# EAGLE schematic uvfoto-avr (EAGLE 6.4)
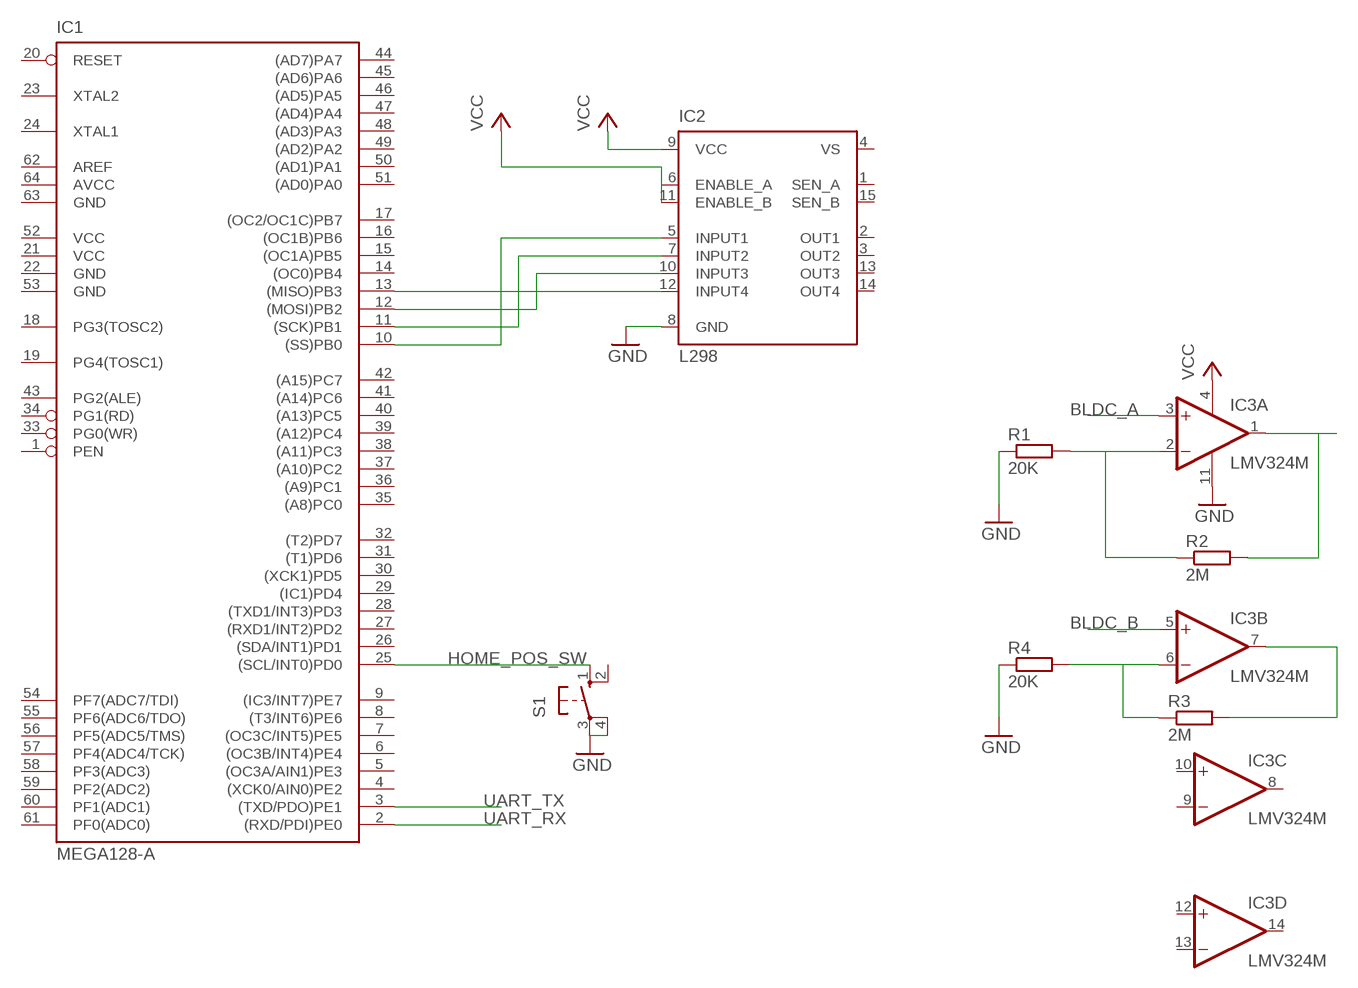
[diagram p0: schematic, sheet 1]

## Parts
IC1  MEGA128-A  [TQFP64]
IC2  L298  [MULTIWATT-15]
IC3  LMV324M  [SO14]
R1  20K  R-EU_0207/10  [0207/10]
R2  2M  R-EU_0207/10  [0207/10]
R3  2M  R-EU_0207/10  [0207/10]
R4  20K  R-EU_0207/10  [0207/10]
S1  10-XX  [B3F-10XX]

## Nets
BLDC_A: IC3.3(A:+IN)
BLDC_B: IC3.5(B:+IN)
GND: IC2.8(GND) IC3.11(P:V-) R1.1 R4.1 S1.4(P1)
HOME_POS_SW: IC1.25((SCL/INT0)PD0) S1.1(S)
IO_PHASE_1: IC3.1(A:OUT) R2.2
N$2: IC1.10((SS)PB0) IC2.5(INPUT1)
N$3: IC1.11((SCK)PB1) IC2.7(INPUT2)
N$4: IC1.12((MOSI)PB2) IC2.10(INPUT3)
N$5: IC1.13((MISO)PB3) IC2.12(INPUT4)
N$6: IC3.2(A:-IN) R1.2 R2.1
N$8: IC3.6(B:-IN) R3.1 R4.2
N$9: IC3.7(B:OUT) R3.2
UART_RX: IC1.2((RXD/PDI)PE0)
UART_TX: IC1.3((TXD/PDO)PE1)
VCC: IC2.9(VCC) IC2.11(ENABLE_B) IC3.4(P:V+)
Unconnected: IC1.1(PEN) IC1.4((XCK0/AIN0)PE2) IC1.5((OC3A/AIN1)PE3) IC1.6((OC3B/INT4)PE4) IC1.7((OC3C/INT5)PE5) IC1.8((T3/INT6)PE6) IC1.9((IC3/INT7)PE7) IC1.14((OC0)PB4) IC1.15((OC1A)PB5) IC1.16((OC1B)PB6) IC1.17((OC2/OC1C)PB7) IC1.18(PG3(TOSC2)) IC1.19(PG4(TOSC1)) IC1.20(RESET) IC1.23(XTAL2) IC1.24(XTAL1) IC1.26((SDA/INT1)PD1) IC1.27((RXD1/INT2)PD2) IC1.28((TXD1/INT3)PD3) IC1.29((IC1)PD4) IC1.30((XCK1)PD5) IC1.31((T1)PD6) IC1.32((T2)PD7) IC1.33(PG0(WR)) IC1.34(PG1(RD)) IC1.35((A8)PC0) IC1.36((A9)PC1) IC1.37((A10)PC2) IC1.38((A11)PC3) IC1.39((A12)PC4) IC1.40((A13)PC5) IC1.41((A14)PC6) IC1.42((A15)PC7) IC1.43(PG2(ALE)) IC1.44((AD7)PA7) IC1.45((AD6)PA6) IC1.46((AD5)PA5) IC1.47((AD4)PA4) IC1.48((AD3)PA3) IC1.49((AD2)PA2) IC1.50((AD1)PA1) IC1.51((AD0)PA0) IC1.54(PF7(ADC7/TDI)) IC1.55(PF6(ADC6/TDO)) IC1.56(PF5(ADC5/TMS)) IC1.57(PF4(ADC4/TCK)) IC1.58(PF3(ADC3)) IC1.59(PF2(ADC2)) IC1.60(PF1(ADC1)) IC1.61(PF0(ADC0)) IC1.62(AREF) IC2.1(SEN_A) IC2.2(OUT1) IC2.3(OUT2) IC2.6(ENABLE_A) IC2.13(OUT3) IC2.14(OUT4) IC2.15(SEN_B) IC3.8(C:OUT) IC3.9(C:-IN) IC3.10(C:+IN) IC3.12(D:+IN) IC3.13(D:-IN) IC3.14(D:OUT) S1.2(S1) S1.3(P)

## Power pins joined to a net without a drawn wire
AVCC: IC1.64(AVCC)
GND: IC1.22(GND) IC1.53(GND) IC1.63(GND)
VCC: IC1.21(VCC) IC1.52(VCC)
VS: IC2.4(VS)

## Library data of the parts
IC1 = atmel:MEGA128: MICROCONTROLLER 128 Kbytes FLASH 4 Kbytes SRAM 4 Kbytes EEPROM DUAL USART 8-channel 10 bit ADC Source: avr.lbr; MPN: ATMEGA128-16AU; OC_FARNELL: 9171118; OC_NEWARK: 95K7364
IC2 = st-microelectronics:L298: DUAL FULL-BRIDGE DRIVER; MPN: L298N; OC_FARNELL: 1589425; OC_NEWARK: 32M1527
IC3 = linear:LMV324?*: Quad General Purpose, Low Voltage, Rail-to-Rail Output Operational Amplifiers Source: http://www.national.com/mpf/LM/LMV321.html http://www.national.com/dt/lmv_qual.pdf
R1-R4 = rcl:R-EU_: RESISTOR, European symbol
S1 = switch-omron:10-XX: OMRON SWITCH; MPN: B3F-1000; OC_FARNELL: 176432; OC_NEWARK: 36M3542